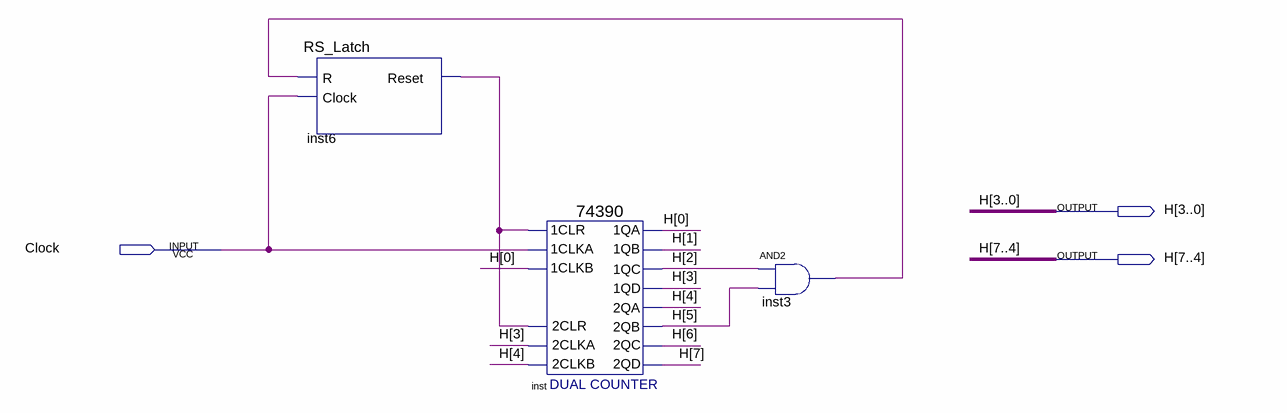
[diagram p0: schematic sheet]
// Quartus schematic Count_Hour.bdf as structural Verilog: 3 symbols, 3 pins
module Count_Hour (
  input  Clock,
  output [7:0] H
);

  wire inst3_out, inst6_reset;

  RS_Latch inst6 (.R(inst3_out), .Clock(Clock), .Reset(inst6_reset));
  \74390  inst (
    .\2CLKA (H[3]), .\2CLR (inst6_reset), .\2CLKB (H[4]), .\1CLR (inst6_reset), .\1CLKA (Clock),
    .\1CLKB (H[0]), .\1QA (H[0]), .\1QB (H[1]), .\1QC (H[2]), .\1QD (H[3]), .\2QA (H[4]), .\2QB (H[5]),
    .\2QC (H[6]), .\2QD (H[7]));
  and inst3 (inst3_out, H[2], H[5]);
endmodule
